# EAGLE design ozongenerator_regulator_ver_0_0_0_date_20210506 (EAGLE 9.6.1)
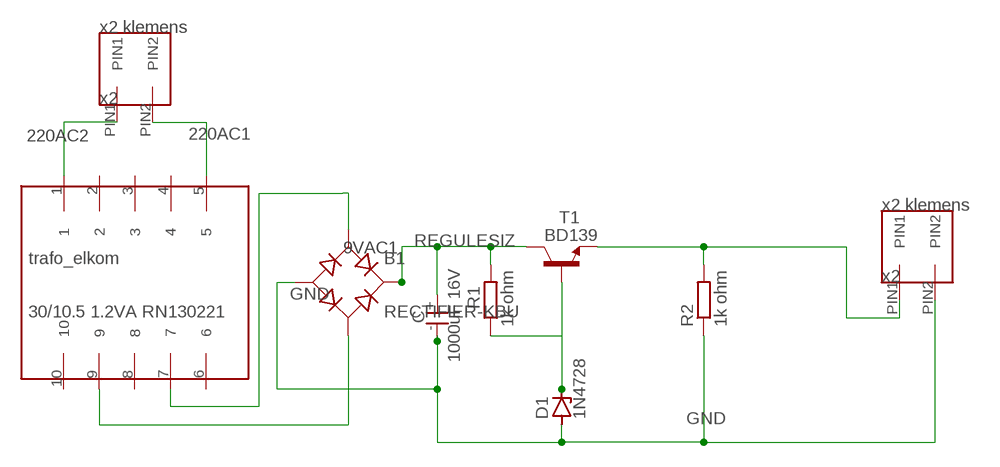
[diagram p0: schematic, sheet 1]

## Parts
B1  RECTIFIER-KBU  [KBU]
D1  1N4728  [DO41Z10]
R1  1k ohm  R-EU_0207/12  [0207/12]
R2  1k ohm  R-EU_0207/12  [0207/12]
T1  BD139  [TO126]
U$1  X2_KLEMENS  [X2_KLEMENS]
U$2  EL_KOM_TRAFO  [EL_KOM_TRAFO]
U$3  CAPACITOR  [CAPACITOR]
U$4  X2_KLEMENS  [X2_KLEMENS]

## Nets
9VAC1: B1.AC1 U$2.7
220AC1: U$1.PIN2 U$2.5
220AC2: U$1.PIN1 U$2.1
GND: B1.- D1.A R2.1 U$3.- U$4.PIN2
N$1: R2.2 T1.1(E) U$4.PIN1
N$2: D1.C R1.1 T1.3(B)
N$3: B1.AC2 U$2.9
REGULESIZ: B1.+ R1.2 T1.2(C) U$3.+
Unconnected: U$2.2 U$2.3 U$2.4 U$2.6 U$2.8 U$2.10

## Library data of the parts
B1 = rectifier2:RECTIFIER-: Rectifier
D1 = diode:1N4728: Z DIODE 3.3 V, 1W, 5 percent
R1 R2 = resistor:R-EU_: RESISTOR, European symbol
T1 = transistor:BD139: NPN TRANSISTOR
U$1 U$4 = klemens:X2_KLEMENS
U$2 = klemens:EL_KOM_TRAFO
U$3 = klemens:CAPACITOR

## Board
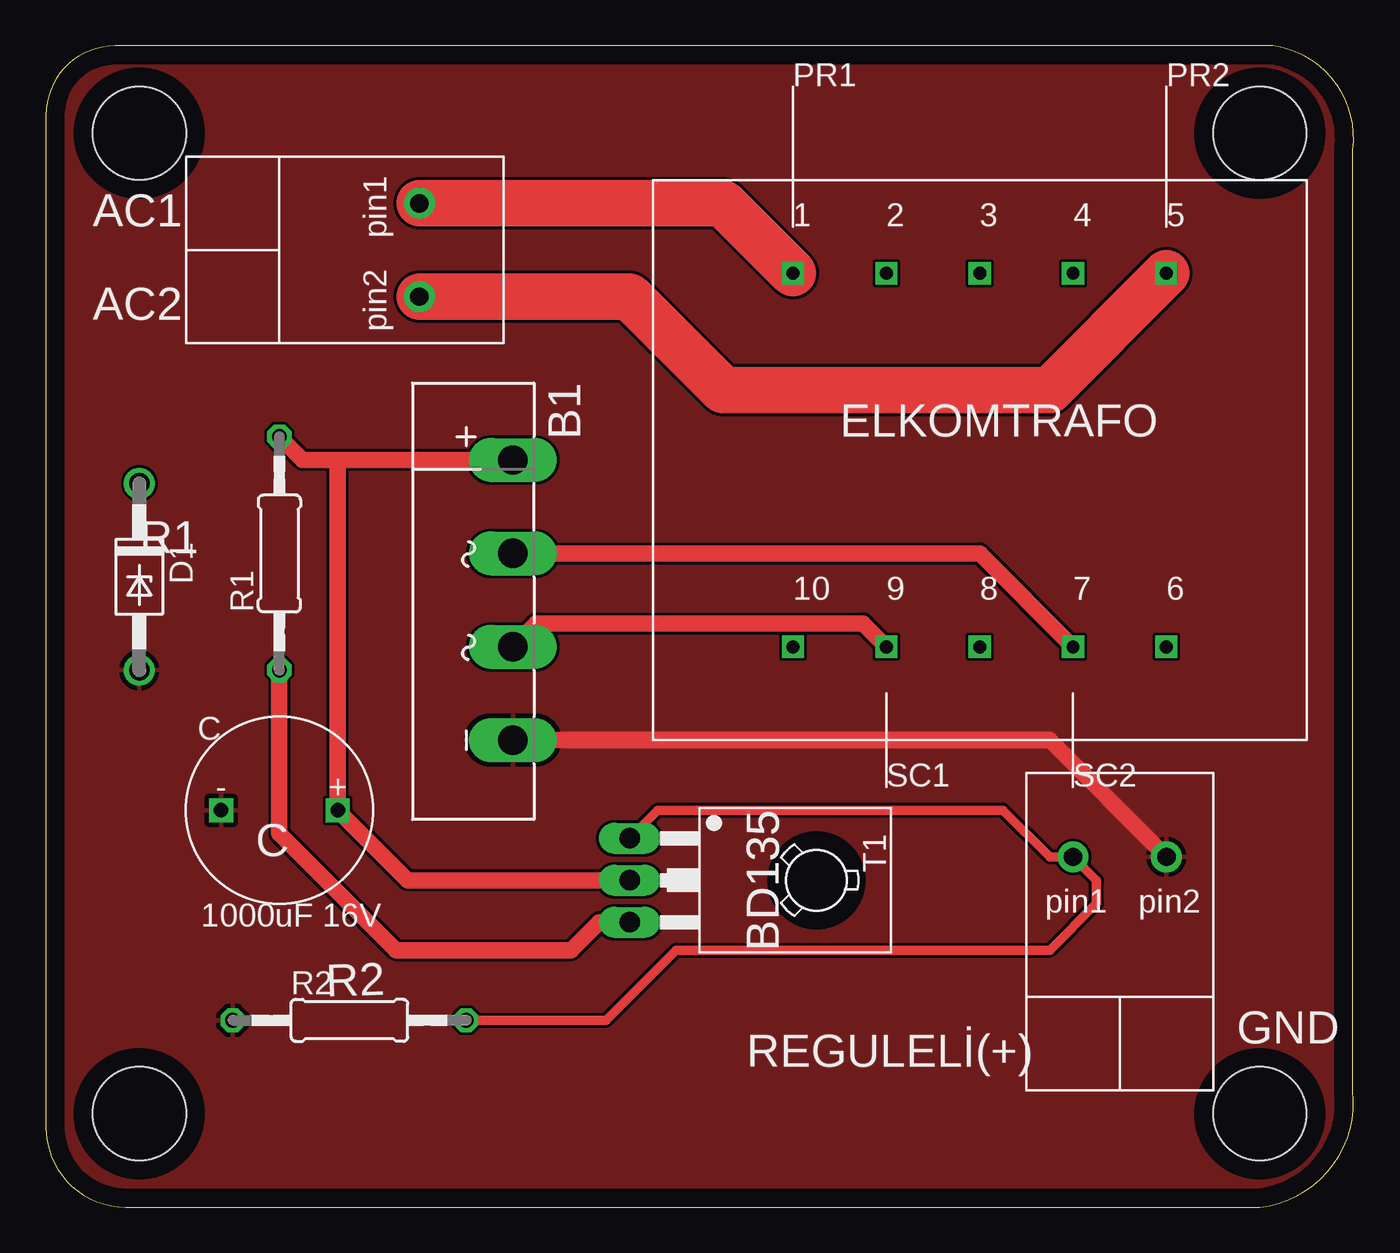
[diagram p1: board, top side]
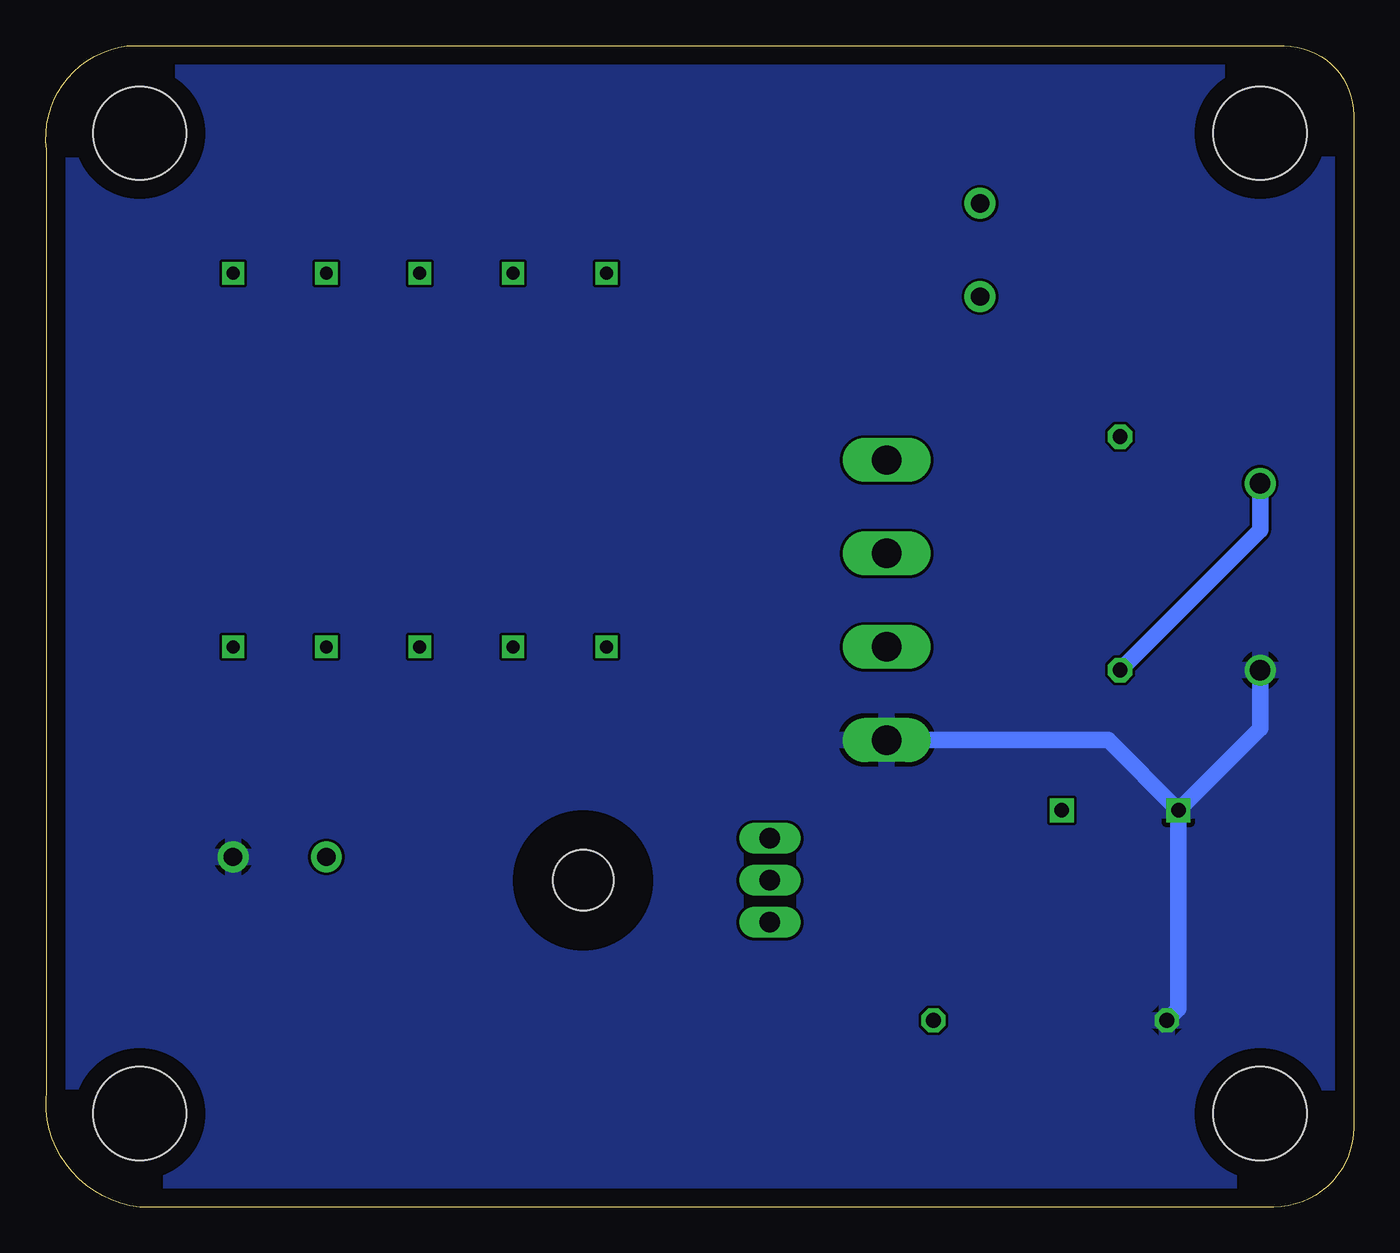
[diagram p2: board, bottom side, seen from below]

Size 71.14 x 63.17 mm. Coordinates in mm from the lower left corner, seen from the top.
Outline: 0,59.41 0,4.34 arc90 4.34,0 66.05,0 arc90 71.1,6.32 71.1,57.53 arc90 66.73,63.17 3.75,63.17 arc90 0,59.41
Copper layers (1*16): Top 0.035mm / dielectric 1.5mm / Bottom 0.035mm
Design rules "default": minimum track width 6mil, minimum drill 0.35mm, track to track 6mil, track to pad 6mil, pad to pad 6mil, via to via 6mil, smd to smd 6mil, copper to edge 40mil, drill to drill 6mil, minimum pad ring 10mil, minimum via ring 8mil, stop-mask expansion 4mil, vias tented up to drill 0mil, thermal gap 10mil
Holes 5.08 mm at 5.08,58.42 66.04,58.42 66.04,5.08 5.08,5.08

### Footprints (pad centres in the part's own frame; a part is rotated, then mirrored left to right if it is on the bottom)
KBU = drill 1.6 long: + -7.62,2.54; - 7.62,2.54; AC1 -2.54,2.54; AC2 2.54,2.54
DO41Z10 = drill 1.118: A 5.08,0; C -5.08,0
0207/12 = drill 0.813 octagon: 1 -6.35,0; 2 6.35,0
TO126 = drill 1.118 long: 1 -2.286,-5.08; 2 0,-5.08; 3 2.286,-5.08 | hole 3.302: 0,5.08
X2_KLEMENS = drill 1 pad 1.676: PIN1 -2.54,1.27; PIN2 2.54,1.27
EL_KOM_TRAFO = drill 0.7 square: 1 -10.16,10.16; 2 -5.08,10.16; 3 0,10.16; 4 5.08,10.16; 5 10.16,10.16; 6 10.16,-10.16; 7 5.08,-10.16; 8 0,-10.16; 9 -5.08,-10.16; 10 -10.16,-10.16
CAPACITOR = drill 0.8 square: + 3.175,0; - -3.175,0

### Placement (x,y rotation side)
B1  22.86,33.02 270 top
D1  5.08,34.29 270 top
R1  12.7,35.56 90 top
R2  16.51,10.16 0 top
T1  36.83,17.78 270 top
U$1  19.05,52.07 270 top
U$2  50.8,40.64 0 top
U$3  12.7,21.59 0 top
U$4  58.42,17.78 0 top

### Tracks (layer width: path | path; a pad name or v marks a point on that pad's centre or on a via)
9VAC1
  Top 0.889: U$2.7 50.8,35.56 B1.AC1
220AC1
  Top 2.54: U$1.PIN2 31.75,49.53 36.83,44.45 54.61,44.45 U$2.5
220AC2
  Top 2.54: U$2.1 36.83,54.61 U$1.PIN1
GND
  Top 0.889: U$4.PIN2 54.61,25.4 B1.-
  Bottom 0.889: U$3.- 5.08,26.04 D1.A | R2.1 9.52,10.8 U$3.- | B1.- 13.33,25.4 U$3.-
  pour Top: -3.81,64.77 74.93,64.77 74.93,-1.27 -3.81,-1.27
  pour Bottom: -6.35,67.31 -6.35,-3.81 77.47,-3.81 77.47,67.31
N$1
  Top 0.508: T1.1 33.27,21.59 52.07,21.59 54.61,19.05 U$4.PIN1 57.15,17.78 57.15,16.51 54.61,13.97 34.29,13.97 30.48,10.16 R2.2
N$2
  Top 0.889: T1.3 30.1,15.49 28.57,13.97 19.05,13.97 12.7,20.32 R1.1
  Bottom 0.889: R1.1 5.08,36.83 D1.C
N$3
  Top 0.889: U$2.9 44.45,31.75 26.67,31.75 B1.AC2
REGULESIZ
  Top 0.889: R1.2 13.97,40.64 15.88,40.64 | B1.+ 15.88,40.64 | 15.88,40.64 U$3.+ 19.68,17.78 T1.2

### Text on the board
tPlace: AC1 | AC2 | ELKOMTRAFO | R1 | BD135 | BD135 | C | R2 | GND | REGULELİ(+)
tDocu: DATE:20210528 / PROJECT: 220VAC TO 5VDC REGULATOR / VERSION:0.0.0 / DESCRIPTION: / thats a regulator first attempt. the values and compenents may varienca. the first aim is the make a pattern for this. next version is theoretically tested with suitable values and components. / in theory: we have 220v ac input at x2 klemens, it goes to elkom's product transformer and voltage downs to the willed value. this signal get dc by full bridge rectifier. we have cap. in here for improving the regulation ratio.the transistor,zener diode and resistor circuit values arranges the output voltage. working prenciple generally like that. / you can contact with me by linkedin: / https://www.linkedin.com/in/emre-muzafferiyet-059280bb/ / github: / https://github.com/emremuzafferiyet